# Altium project A7 Minima.PrjPcb (part 1 of 3)
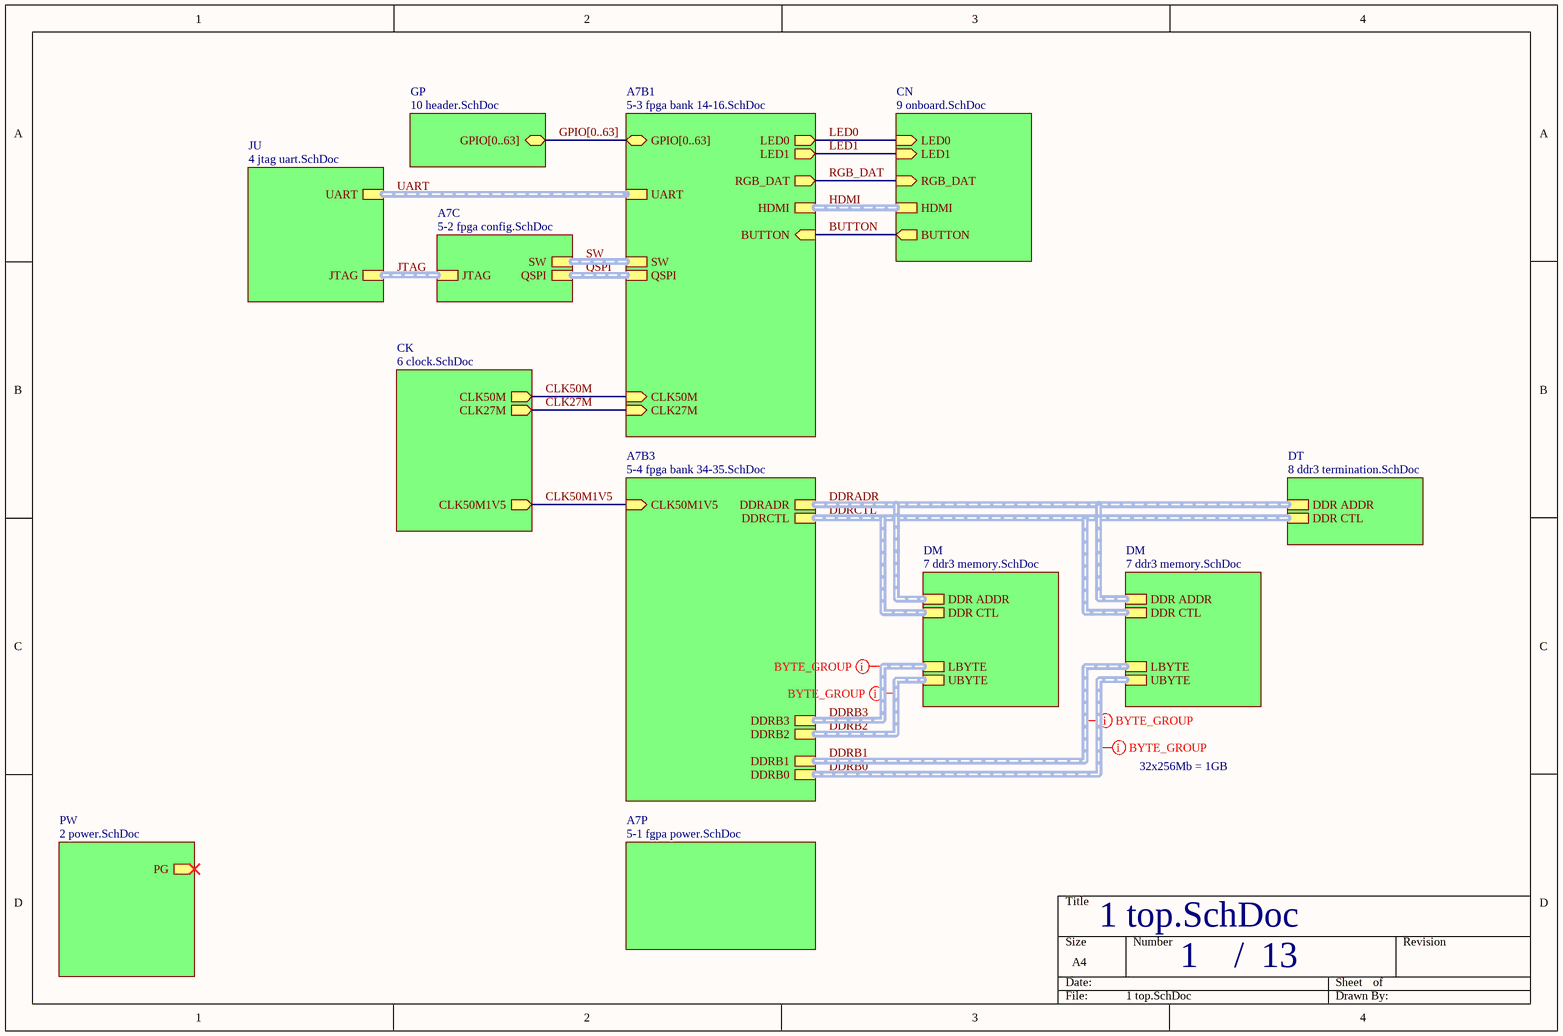
[diagram p0: 1 top.SchDoc]
13 sheets, 313 parts. Net scope: hierarchical (ports join the sheet entries above them; power ports are global).
Board files: main.PcbDoc, panel.PcbDoc
Sheets:
  1 top.SchDoc
    PW = 2 power.SchDoc
      BC = 3 buck.SchDoc
      BC = 3 buck.SchDoc
      BC = 3 buck.SchDoc
      BC = 3 buck.SchDoc
    A7P = 5-1 fgpa power.SchDoc
    CN = 9 onboard.SchDoc
    CK = 6 clock.SchDoc
    A7B3 = 5-4 fpga bank 34-35.SchDoc
    A7B1 = 5-3 fpga bank 14-16.SchDoc
    JU = 4 jtag uart.SchDoc
    A7C = 5-2 fpga config.SchDoc
    DM = 7 ddr3 memory.SchDoc
    DM = 7 ddr3 memory.SchDoc
    DT = 8 ddr3 termination.SchDoc
    GP = 10 header.SchDoc

## Sheet 1 top.SchDoc
size A4; SheetNumber: 1; SheetTotal: 13

### Sub-sheets
A7B1 = 5-3 fpga bank 14-16.SchDoc: CLK50M (in), CLK27M (in), UART (harness UART), QSPI (harness QSPI), SW (harness SW), HDMI (harness HDMI), RGB_DAT (out), GPIO[0..63] (bidir), BUTTON (in), LED0 (out), LED1 (out)
A7B3 = 5-4 fpga bank 34-35.SchDoc: DDRADR (harness DDR ADDR), DDRCTL (harness DDR CTL), DDRB3 (harness DDR BYTE), DDRB2 (harness DDR BYTE), DDRB1 (harness DDR BYTE), DDRB0 (harness DDR BYTE), CLK50M1V5 (in)
A7C = 5-2 fpga config.SchDoc: JTAG (harness JTAG), QSPI (harness QSPI), SW (harness SW)
A7P = 5-1 fgpa power.SchDoc: no entries
CK = 6 clock.SchDoc: CLK50M (out), CLK27M (out), CLK50M1V5 (out)
CN = 9 onboard.SchDoc: RGB_DAT (in), BUTTON (out), LED0 (in), LED1 (in), HDMI (harness HDMI)
DM = 7 ddr3 memory.SchDoc: LBYTE (harness DDR BYTE), UBYTE (harness DDR BYTE), DDR ADDR (harness DDR ADDR), DDR CTL (harness DDR CTL)
DM = 7 ddr3 memory.SchDoc: LBYTE (harness DDR BYTE), UBYTE (harness DDR BYTE), DDR ADDR (harness DDR ADDR), DDR CTL (harness DDR CTL)
DT = 8 ddr3 termination.SchDoc: DDR ADDR (harness DDR ADDR), DDR CTL (harness DDR CTL)
GP = 10 header.SchDoc: GPIO[0..63] (bidir)
JU = 4 jtag uart.SchDoc: JTAG (harness JTAG), UART (harness UART)
PW = 2 power.SchDoc: PG (out)

### Nets
BUTTON: sheet CN/BUTTON, sheet A7B1/BUTTON
CLK27M: sheet CK/CLK27M, sheet A7B1/CLK27M
CLK50M: sheet CK/CLK50M, sheet A7B1/CLK50M
CLK50M1V5: sheet CK/CLK50M1V5, sheet A7B3/CLK50M1V5
LED0: sheet CN/LED0, sheet A7B1/LED0
LED1: sheet CN/LED1, sheet A7B1/LED1
RGB_DAT: sheet CN/RGB_DAT, sheet A7B1/RGB_DAT

### Buses and harness runs
bus GPIO[0..63] = sheet A7B1/GPIO[0..63] = sheet GP/GPIO[0..63]
harness DDRADR = sheet A7B3/DDRADR = sheet DM/DDR ADDR = sheet DT/DDR ADDR
harness DDRB0 = sheet A7B3/DDRB0 = sheet DM/UBYTE
harness DDRB1 = sheet A7B3/DDRB1 = sheet DM/LBYTE
harness DDRB2 = sheet A7B3/DDRB2 = sheet DM/UBYTE
harness DDRB3 = sheet A7B3/DDRB3 = sheet DM/LBYTE
harness DDRCTL = sheet A7B3/DDRCTL = sheet DM/DDR CTL = sheet DT/DDR CTL
harness HDMI = sheet A7B1/HDMI = sheet CN/HDMI
harness JTAG = sheet A7C/JTAG = sheet JU/JTAG
harness QSPI = sheet A7B1/QSPI = sheet A7C/QSPI
harness SW = sheet A7B1/SW = sheet A7C/SW
harness UART = sheet A7B1/UART = sheet JU/UART

### Layout directives
net class BYTE_GROUP3: (no net found under the mark)
net class BYTE_GROUP2: (no net found under the mark)
net class BYTE_GROUP1: (no net found under the mark)
net class BYTE_GROUP0: (no net found under the mark)

### Notes on the sheet
- 32x256Mb = 1GB
- /

## Sheet 2 power.SchDoc
size A4; SheetNumber: 2; SheetTotal: 13
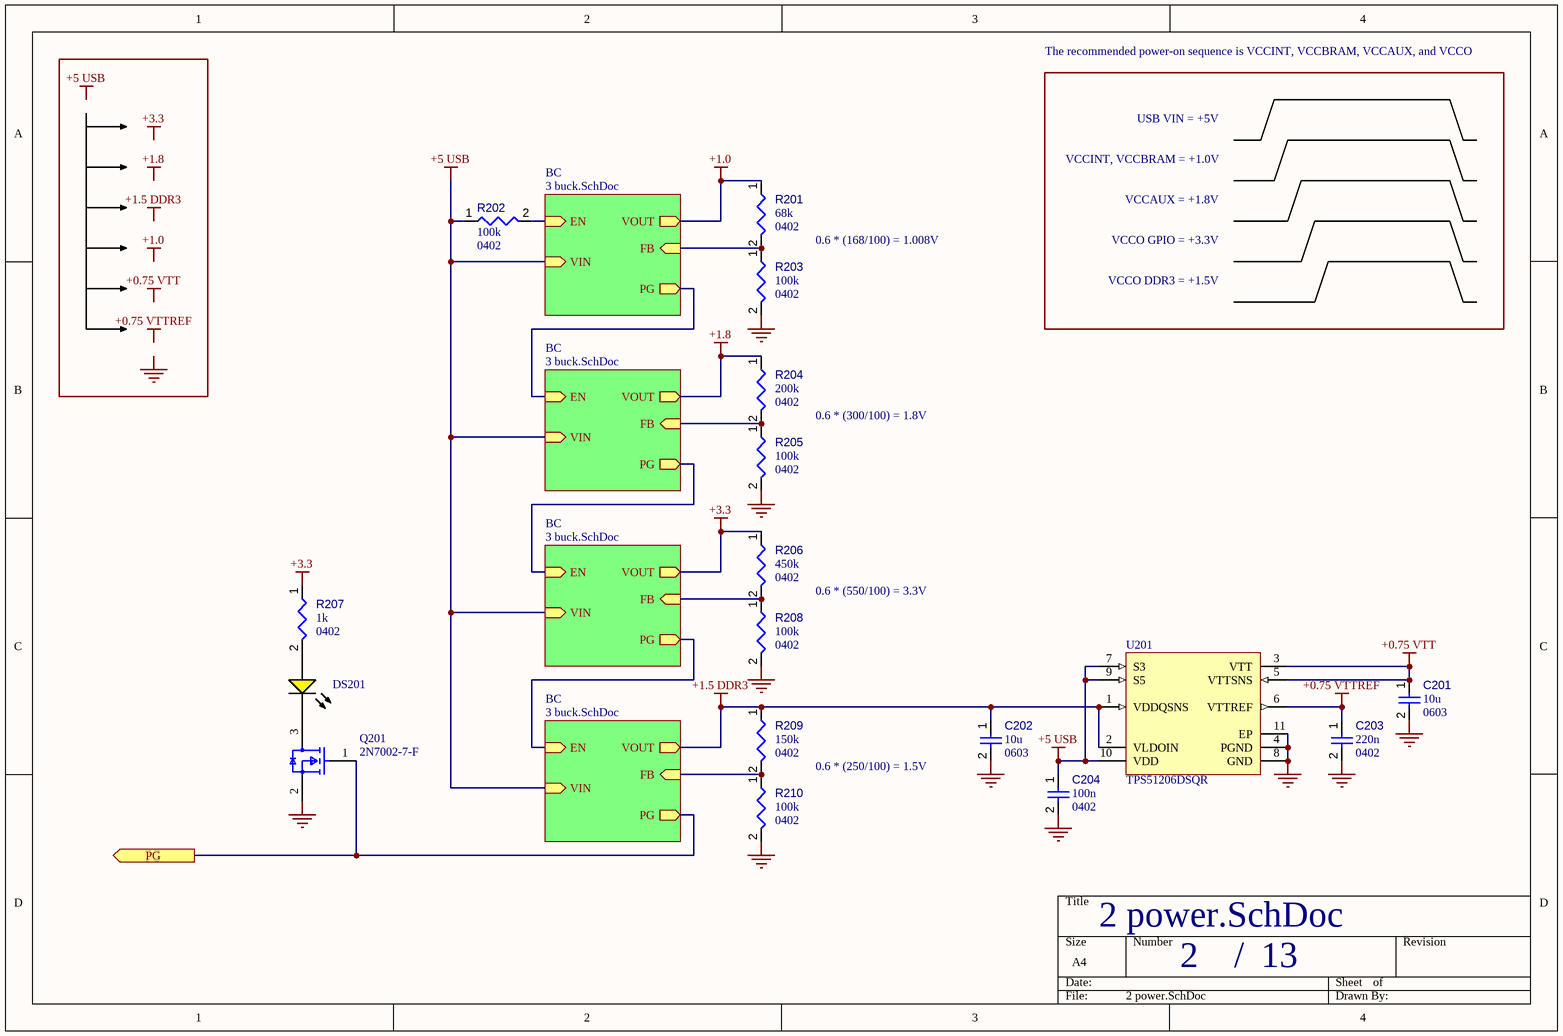
[diagram p1: 2 power.SchDoc]

### Parts
C201  value 10u  Case/Package: 0603  [CAPC0603(1608)100_L]  (hidden comment: Capacitors,0603,10u)
C202  value 10u  Case/Package: 0603  [CAPC0603(1608)100_L]  (hidden comment: Capacitors,0603,10u)
C203  value 220n  Case/Package: 0402  [CAPC0402(1005)60_L]  (hidden comment: Capacitors,0402,220n,16)
C204  value 100n  Case/Package: 0402  [CAPC0402(1005)60_L]  (hidden comment: Capacitors,0402,100n,16)
DS201  SML-LX0603YW-TR  [LUMX-SML-LX0603_V]  (value not drawn)
Q201  2N7002-7-F  [FP-SOT23-MFG]
R201  value 68k  Case/Package: 0402  [RESC0402(1005)_L]  (hidden comment: Resistors,0402,1%,68k)
R202  value 100k  Case/Package: 0402  [RESC0402(1005)_L]  (hidden comment: Resistors,0402,1%,100k)
R203  value 100k  Case/Package: 0402  [RESC0402(1005)_L]  (hidden comment: Resistors,0402,1%,100k)
R204  value 200k  Case/Package: 0402  [RESC0402(1005)_L]  (hidden comment: Resistors,0402,1%,200k)
R205  value 100k  Case/Package: 0402  [RESC0402(1005)_L]  (hidden comment: Resistors,0402,1%,100k)
R206  value 450k  Case/Package: 0402  [RESC0402(1005)_L]  (hidden comment: Resistors,0402,1%,450k)
R207  value 1k  Case/Package: 0402  [RESC0402(1005)_L]  (hidden comment: Resistors,0402,1k)
R208  value 100k  Case/Package: 0402  [RESC0402(1005)_L]  (hidden comment: Resistors,0402,1%,100k)
R209  value 150k  Case/Package: 0402  [RESC0402(1005)_L]  (hidden comment: Resistors,0402,1%,150k)
R210  value 100k  Case/Package: 0402  [RESC0402(1005)_L]  (hidden comment: Resistors,0402,1%,100k)
U201  TPS51206DSQR  [DSQ0010A_V]

### Sub-sheets
BC = 3 buck.SchDoc: EN (in), FB (in), VOUT (out), PG (out), VIN (in)
BC = 3 buck.SchDoc: EN (in), FB (in), VOUT (out), PG (out), VIN (in)
BC = 3 buck.SchDoc: EN (in), FB (in), VOUT (out), PG (out), VIN (in)
BC = 3 buck.SchDoc: EN (in), FB (in), VOUT (out), PG (out), VIN (in)

### Ports
PG (out)

### Nets
+0.75 VTT: C201.1 U201.3(VTT) U201.5(VTTSNS)
+0.75 VTTREF: C203.1 U201.6(VTTREF)
+1.0: R201.1 ; sheet BC/VOUT
+1.5 DDR3: C202.1 R209.1 U201.1(VDDQSNS) U201.2(VLDOIN) ; sheet BC/VOUT
+1.8: R204.1 ; sheet BC/VOUT
+3.3: R206.1 R207.1 ; sheet BC/VOUT
+5 USB: C204.1 R202.1 U201.7(S3) U201.9(S5) U201.10(VDD) ; sheet BC/VIN, sheet BC/VIN, sheet BC/VIN, sheet BC/VIN
GND: C201.2 C202.2 C203.2 C204.2 Q201.2(S) R203.2 R205.2 R208.2 R210.2 U201.4(PGND) U201.8(GND) U201.11(EP)
EN: R202.2 ; sheet BC/EN
EN: sheet BC/PG, sheet BC/EN  [a separate net that carries the same name]
EN: sheet BC/PG, sheet BC/EN  [a separate net that carries the same name]
EN: sheet BC/PG, sheet BC/EN  [a separate net that carries the same name]
FB: R201.2 R203.1 ; sheet BC/FB
FB: R204.2 R205.1 ; sheet BC/FB  [a separate net that carries the same name]
FB: R206.2 R208.1 ; sheet BC/FB  [a separate net that carries the same name]
FB: R209.2 R210.1 ; sheet BC/FB  [a separate net that carries the same name]
PG: Q201.1(G) ; port PG, sheet BC/PG
NetDS201_1: DS201.1(A) R207.2
NetDS201_2: DS201.2(K) Q201.3(D)

### Notes on the sheet
- The recommended power-on sequence is VCCINT, VCCBRAM, VCCAUX, and VCCO
- VCCINT, VCCBRAM = +1.0V
- USB VIN = +5V
- 0.6 * (168/100) = 1.008V
- VCCAUX = +1.8V
- VCCO GPIO = +3.3V
- VCCO DDR3 = +1.5V
- 0.6 * (300/100) = 1.8V
- 0.6 * (550/100) = 3.3V
- 0.6 * (250/100) = 1.5V
- /
- Labels drawn without touching a wire or pin: +0.75 VTT, +0.75 VTTREF, +1.0, +1.5 DDR3, +1.8, +3.3, +5 USB, GND

### Library data of the parts
C201 C202 = Capacitors: Capacitor; Component Type: Capacitors
C203 C204 = Capacitors: Capacitor; Voltage Rating: 16; Component Type: Capacitors
DS201 = CMP-2000-07121-1: Yellow LED, Milky White Diffused Lens, 2.1 V, 14 mcd, -25 to 85 degC, 2-Pin SMD, RoHS, Tape and Reel; Manufacturer: Lumex; COO: CN; Number of LEDs: 1; Type: Uni-Color; Intensity: 14mcd; Reverse Voltage: 5(Min)V; LED Material: GaAsP; Viewing Angle: 160; Peak Wavelength: 585nm; Pin_Count: 2; Lens Appearance: ColorlessDiffused; Operating Temperature: -25to85C; Color: Yellow; Mounting Technology: SurfaceMount; Package Description: 2-Pin Surface Mount Device, Body 1.6 x 0.8 mm; Mounting: SurfaceMount; Packaging: TapeandReel; RoHS: Unknown; Supplier_Package: SMD; Package Reference: SML-LX00603; Part No: SML-LX0603YW-TR; Datasheet URL: http://www.lumex.com/content/files/ProductAttachment/SML-LX0603YW-TR.pdf; Dimension: 1.6x0.8x0.6mm; Manufacturer URL: http://www.lumexinstruments.com/; HTS: 8541402000; Datasheet Version: Rev. G, 09/2013; Lens Dimensions: 1x0.8x0.3mm; Dominant Wavelength: N/A; ECCN: EARII; Supplier: Lumex; Family: SML-LX0603YW
Q201 = CMP-2000-04929-2: MOSFET N-CH 60V 115MA SOT23-3; Turn-On Delay Time: 7ns; Turn-Off Delay Time: 11ns; Drain to Source Resistance: 7.5R; Rise Time: 3ns; Drain to Source Breakdown Voltage: 70V; Input Capacitance: 50pF; Number of Elements: 1; Power Dissipation: 540mW; Max Power Dissipation: 300mW; Fall Time: 5.6ns; Gate to Source Voltage (Vgs): 20V; Threshold Voltage: 2.5V; Element Configuration: Single; Termination: SMD/SMT; Weight: 0.000282oz; Radiation Hardening: No; Max Operating Temperature: 150°C; On-State Resistance: 7.5R; Mount: Surface Mount; Current Rating: 115mA; Contact Plating: Tin; Lead Free: Lead Free; Min Operating Temperature: -55°C; Number of Pins: 3; REACH SVHC: No SVHC; Drain to Source Voltage (Vdss): 60V; Width: 1.3mm; Package Quantity: 3000; Length: 2.9mm; Case/Package: SOT-23; Number of Channels: 1; Dual Supply Voltage: 60V; Packaging: Tape and Reel; Height: 1mm; Voltage Rating (DC): 60V; Nominal Vgs: 2.5V; Continuous Drain Current (ID): 115mA; Voltage: 60V; Rds On Max: 7.5R
R201-R210 = Resistors: Resistor; Component Type: Resistors
  R201-R206 R208-R210: Tolerance: 1%
U201 = CMP-0395-00678-2: Single Output LDO, 2 A, with VTTREF Buffered Reference for DDR2, DDR3, DDR3L, 10-pin SON (DSQ), -40 to 85 degC, Green (RoHS & no Sb/Br); Manufacturer: Texas Instruments; SubFamily: Single Channel LDO; Iout(Max)(A): 2; Rating: Catalog; ComponentLink2Description: Datasheet; ComponentLink1URL: http://www.ti.com/; ComponentLink4URL: Samples URL:http://www.ti.com/product/tps51206#samples; PackageVersion: 4209243/B; Mounting Technology: Surface Mount; PackageReference: DSQ0010A; Eco-Plan: Green (RoHS & no Sb/Br); PackageDescription: 10-Pin Plastic Small Outline, Body 2 X 2 mm, Pitch 0.4 mm; ComponentLink4Description: URL Link1; DatasheetVersion: SLUSAH1; ComponentLink3URL: http://www.ti.com/litv/pdf/mpdi002c; ComponentLink2URL: http://www.ti.com/general/docs/lit/getliterature.tsp?genericPartNumber=TPS51206&fileType=pdf; PartNumber: TPS51206DSQR; ComponentLink3Description: Package Specification; ComponentLink1Description: Manufacturer URL

## Sheet 3 buck.SchDoc
size A4; SheetNumber: 3; SheetTotal: 13
Used 4 times, as channels PW/BC, PW/BC, PW/BC, PW/BC. Parts and nets are listed once, with the designators drawn on the sheet.
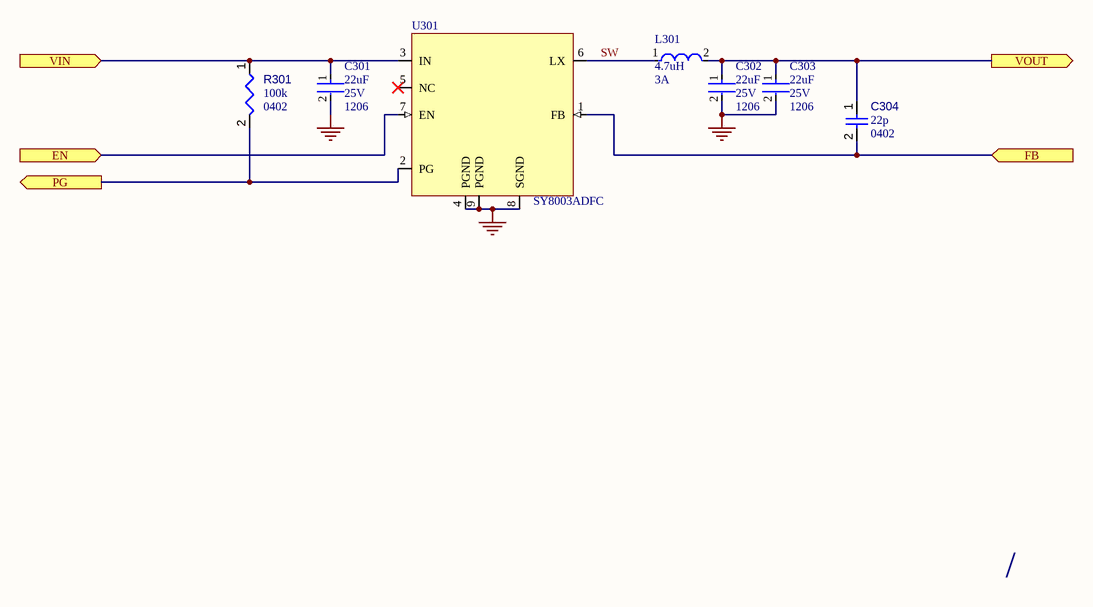
[diagram p2: 3 buck.SchDoc]

### Parts
C301  Capacitance: 22uF  Voltage Rating (DC): 25V  Case Code (Imperial): 1206  [FP-1206-L_3_2_0_3-W_1_6_0-MFG]  (hidden comment: TMK316BBJ226ML-T)
C302  Capacitance: 22uF  Voltage Rating (DC): 25V  Case Code (Imperial): 1206  [FP-1206-L_3_2_0_3-W_1_6_0-MFG]  (hidden comment: TMK316BBJ226ML-T)
C303  Capacitance: 22uF  Voltage Rating (DC): 25V  Case Code (Imperial): 1206  [FP-1206-L_3_2_0_3-W_1_6_0-MFG]  (hidden comment: TMK316BBJ226ML-T)
C304  value 22p  Case/Package: 0402  [CAPC0402(1005)60_L]  (hidden comment: Capacitors,0402,22p)
L301  Inductance: 4.7uH  Current Rating: 3A  [FP-IHLP-2525AH-FP_2_413x3-MFG]  (hidden comment: IHLP2525AHER4R7M01)
R301  value 100k  Case/Package: 0402  [RESC0402(1005)_L]  (hidden comment: Resistors,0402,1%,100k)
U301  SY8003ADFC  [DFN2x2-8]

### Ports
EN (in), FB (in), PG (out), VIN (in), VOUT (out)

### Nets
GND: C301.2 C302.2 C303.2 U301.4(PGND) U301.8(SGND) U301.9(PGND)
EN: U301.7(EN) ; port EN
FB: C304.2 U301.1(FB) ; port FB
PG: R301.2 U301.2(PG) ; port PG
SW: L301.1 U301.6(LX)  [project net SW_3]
VIN: C301.1 R301.1 U301.3(IN) ; port VIN
VOUT: C302.1 C303.1 C304.1 L301.2 ; port VOUT

Not connected (* = marked no-connect by the designer): U301 5(NC)*

### Channels
PW/BC: designators end in _PW_BC#1; ports EN=EN FB=FB PG=EN VIN=+5 USB VOUT=+1.0
PW/BC: designators end in _PW_BC#2; ports EN=EN FB=FB PG=EN VIN=+5 USB VOUT=+1.8
PW/BC: designators end in _PW_BC#3; ports EN=EN FB=FB PG=EN VIN=+5 USB VOUT=+3.3
PW/BC: designators end in _PW_BC#4; ports EN=EN FB=FB PG=PG VIN=+5 USB VOUT=+1.5 DDR3

### Notes on the sheet
- /

### Library data of the parts
C301-C303 = CMP-14477-000100-2: None; Tolerance: 20%; Dielectric: X5R; Resistor Type: Ceramic; Length: 3.2mm; RoHS Compliant: Yes; Case Code (Metric): 3216; Halogen Free: Halogen Free; Series: M; Termination: SMD/SMT; Voltage Rating: 25V; Packaging: Tape and Reel; Width: 0.063inch; Height: 1.6mm; Thickness: 0.075inch; Min Operating Temperature: -55°C; Case/Package: 1206; Mount: Surface Mount; Max Operating Temperature: 85°C; Weight: 0.000571oz; Construction: Flat; Package Quantity: 2000
C304 = Capacitors: Capacitor; Component Type: Capacitors
L301 = CMP-02424-000390-1: Commercial Inductors, High Saturation Series 4.7uH 3A 78mΩ 20%; Test Frequency: 100kHz; DC Resistance (DCR): 78mR; Saturation Current: 8A; Core Material: Metal; Shielding: Shielded; Self Resonant Frequency: 5MHz; Packaging: Tape and Reel; Height: 1.8mm; Case/Package: 2525; Mount: Surface Mount; Min Operating Temperature: -55°C; Package Quantity: 2000; RMS Current (Irms): 3A; Radiation Hardening: No; Termination: SMD/SMT; Length: 6.86mm; Military Standard: Not; Max DC Current: 8A; Depth: 6.72mm; Height - Seated (Max): 0.071inch; Tolerance: 20%; Lead Free: Lead Free; Inductance Tolerance: 20%; Width: 6.47mm; Max Operating Temperature: 125°C
R301 = Resistors: Resistor; Tolerance: 1%; Component Type: Resistors
U301 = SY8003ADFC: High Efficiency 5.5V, 3A Continuous, 1MHz Synchronous Step Down Regulator; Manufacturer: Silergy; Manufacturer Part Number: High Efficiency 5.5V, 3A continuous, 1MHz; LCSC: C178236

## Sheet 5-1 fgpa power.SchDoc
size A4; SheetNumber: 5; SheetTotal: 13
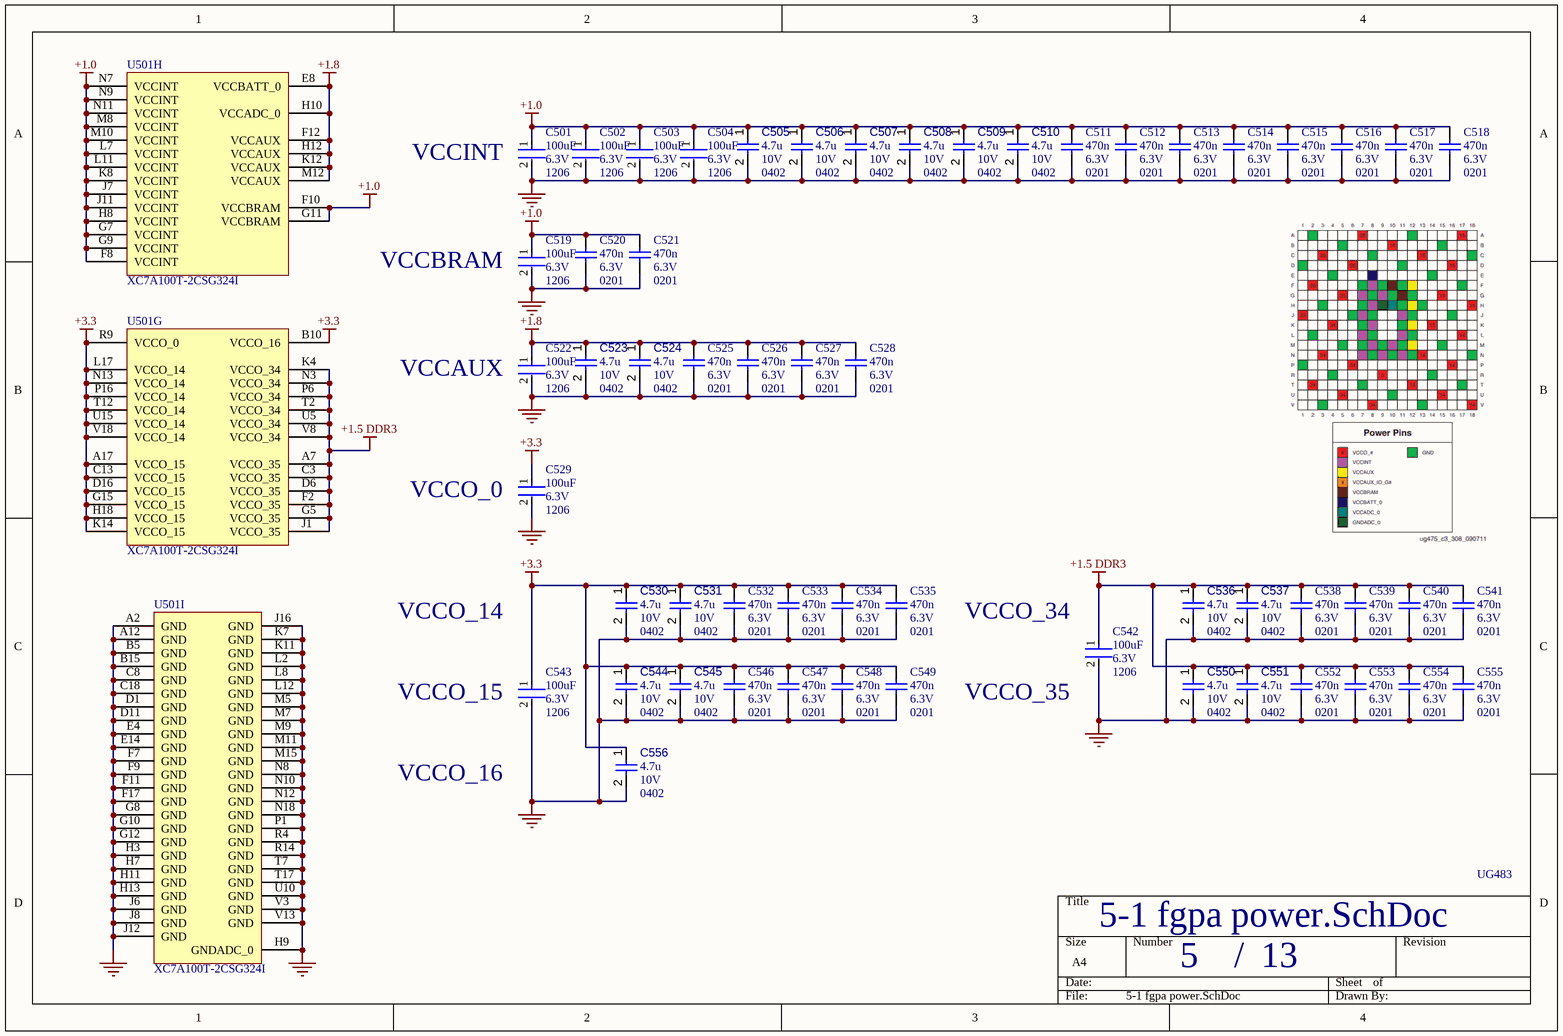
[diagram p3: 5-1 fgpa power.SchDoc]

### Parts
C501  Case Code (Imperial): 1206  Voltage Rating (DC): 6.3V  Capacitance: 100uF  [FP-C1206C-EH-MFG]  (hidden comment: C1206C107M9PACTU)
C502  Case Code (Imperial): 1206  Voltage Rating (DC): 6.3V  Capacitance: 100uF  [FP-C1206C-EH-MFG]  (hidden comment: C1206C107M9PACTU)
C503  Case Code (Imperial): 1206  Voltage Rating (DC): 6.3V  Capacitance: 100uF  [FP-C1206C-EH-MFG]  (hidden comment: C1206C107M9PACTU)
C504  Case Code (Imperial): 1206  Voltage Rating (DC): 6.3V  Capacitance: 100uF  [FP-C1206C-EH-MFG]  (hidden comment: C1206C107M9PACTU)
C505  value 4.7u  Case/Package: 0402  Voltage Rating: 10V  [CAPC0402(1005)60_L]  (hidden comment: Capacitors,0402,4.7u,10V)
C506  value 4.7u  Case/Package: 0402  Voltage Rating: 10V  [CAPC0402(1005)60_L]  (hidden comment: Capacitors,0402,4.7u,10V)
C507  value 4.7u  Case/Package: 0402  Voltage Rating: 10V  [CAPC0402(1005)60_L]  (hidden comment: Capacitors,0402,4.7u,10V)
C508  value 4.7u  Case/Package: 0402  Voltage Rating: 10V  [CAPC0402(1005)60_L]  (hidden comment: Capacitors,0402,4.7u,10V)
C509  value 4.7u  Case/Package: 0402  Voltage Rating: 10V  [CAPC0402(1005)60_L]  (hidden comment: Capacitors,0402,4.7u,10V)
C510  value 4.7u  Case/Package: 0402  Voltage Rating: 10V  [CAPC0402(1005)60_L]  (hidden comment: Capacitors,0402,4.7u,10V)
C511  value 470n  Voltage Rating: 6.3V  Package: 0201  [CAPC0603X33X15LL03T05]  (hidden comment: 02016D474KAT2A)
C512  value 470n  Voltage Rating: 6.3V  Package: 0201  [CAPC0603X33X15LL03T05]  (hidden comment: 02016D474KAT2A)
C513  value 470n  Voltage Rating: 6.3V  Package: 0201  [CAPC0603X33X15LL03T05]  (hidden comment: 02016D474KAT2A)
C514  value 470n  Voltage Rating: 6.3V  Package: 0201  [CAPC0603X33X15LL03T05]  (hidden comment: 02016D474KAT2A)
C515  value 470n  Voltage Rating: 6.3V  Package: 0201  [CAPC0603X33X15LL03T05]  (hidden comment: 02016D474KAT2A)
C516  value 470n  Voltage Rating: 6.3V  Package: 0201  [CAPC0603X33X15LL03T05]  (hidden comment: 02016D474KAT2A)
C517  value 470n  Voltage Rating: 6.3V  Package: 0201  [CAPC0603X33X15LL03T05]  (hidden comment: 02016D474KAT2A)
C518  value 470n  Voltage Rating: 6.3V  Package: 0201  [CAPC0603X33X15LL03T05]  (hidden comment: 02016D474KAT2A)
C519  Case Code (Imperial): 1206  Voltage Rating (DC): 6.3V  Capacitance: 100uF  [FP-C1206C-EH-MFG]  (hidden comment: C1206C107M9PACTU)
C520  value 470n  Voltage Rating: 6.3V  Package: 0201  [CAPC0603X33X15LL03T05]  (hidden comment: 02016D474KAT2A)
C521  value 470n  Voltage Rating: 6.3V  Package: 0201  [CAPC0603X33X15LL03T05]  (hidden comment: 02016D474KAT2A)
C522  Case Code (Imperial): 1206  Voltage Rating (DC): 6.3V  Capacitance: 100uF  [FP-C1206C-EH-MFG]  (hidden comment: C1206C107M9PACTU)
C523  value 4.7u  Case/Package: 0402  Voltage Rating: 10V  [CAPC0402(1005)60_L]  (hidden comment: Capacitors,0402,4.7u,10V)
C524  value 4.7u  Case/Package: 0402  Voltage Rating: 10V  [CAPC0402(1005)60_L]  (hidden comment: Capacitors,0402,4.7u,10V)
C525  value 470n  Voltage Rating: 6.3V  Package: 0201  [CAPC0603X33X15LL03T05]  (hidden comment: 02016D474KAT2A)
C526  value 470n  Voltage Rating: 6.3V  Package: 0201  [CAPC0603X33X15LL03T05]  (hidden comment: 02016D474KAT2A)
C527  value 470n  Voltage Rating: 6.3V  Package: 0201  [CAPC0603X33X15LL03T05]  (hidden comment: 02016D474KAT2A)
C528  value 470n  Voltage Rating: 6.3V  Package: 0201  [CAPC0603X33X15LL03T05]  (hidden comment: 02016D474KAT2A)
C529  Case Code (Imperial): 1206  Voltage Rating (DC): 6.3V  Capacitance: 100uF  [FP-C1206C-EH-MFG]  (hidden comment: C1206C107M9PACTU)
C530  value 4.7u  Case/Package: 0402  Voltage Rating: 10V  [CAPC0402(1005)60_L]  (hidden comment: Capacitors,0402,4.7u,10V)
C531  value 4.7u  Case/Package: 0402  Voltage Rating: 10V  [CAPC0402(1005)60_L]  (hidden comment: Capacitors,0402,4.7u,10V)
C532  value 470n  Voltage Rating: 6.3V  Package: 0201  [CAPC0603X33X15LL03T05]  (hidden comment: 02016D474KAT2A)
C533  value 470n  Voltage Rating: 6.3V  Package: 0201  [CAPC0603X33X15LL03T05]  (hidden comment: 02016D474KAT2A)
C534  value 470n  Voltage Rating: 6.3V  Package: 0201  [CAPC0603X33X15LL03T05]  (hidden comment: 02016D474KAT2A)
C535  value 470n  Voltage Rating: 6.3V  Package: 0201  [CAPC0603X33X15LL03T05]  (hidden comment: 02016D474KAT2A)
C536  value 4.7u  Case/Package: 0402  Voltage Rating: 10V  [CAPC0402(1005)60_L]  (hidden comment: Capacitors,0402,4.7u,10V)
C537  value 4.7u  Case/Package: 0402  Voltage Rating: 10V  [CAPC0402(1005)60_L]  (hidden comment: Capacitors,0402,4.7u,10V)
C538  value 470n  Voltage Rating: 6.3V  Package: 0201  [CAPC0603X33X15LL03T05]  (hidden comment: 02016D474KAT2A)
C539  value 470n  Voltage Rating: 6.3V  Package: 0201  [CAPC0603X33X15LL03T05]  (hidden comment: 02016D474KAT2A)
C540  value 470n  Voltage Rating: 6.3V  Package: 0201  [CAPC0603X33X15LL03T05]  (hidden comment: 02016D474KAT2A)
C541  value 470n  Voltage Rating: 6.3V  Package: 0201  [CAPC0603X33X15LL03T05]  (hidden comment: 02016D474KAT2A)
C542  Case Code (Imperial): 1206  Voltage Rating (DC): 6.3V  Capacitance: 100uF  [FP-C1206C-EH-MFG]  (hidden comment: C1206C107M9PACTU)
C543  Case Code (Imperial): 1206  Voltage Rating (DC): 6.3V  Capacitance: 100uF  [FP-C1206C-EH-MFG]  (hidden comment: C1206C107M9PACTU)
C544  value 4.7u  Case/Package: 0402  Voltage Rating: 10V  [CAPC0402(1005)60_L]  (hidden comment: Capacitors,0402,4.7u,10V)
C545  value 4.7u  Case/Package: 0402  Voltage Rating: 10V  [CAPC0402(1005)60_L]  (hidden comment: Capacitors,0402,4.7u,10V)
C546  value 470n  Voltage Rating: 6.3V  Package: 0201  [CAPC0603X33X15LL03T05]  (hidden comment: 02016D474KAT2A)
C547  value 470n  Voltage Rating: 6.3V  Package: 0201  [CAPC0603X33X15LL03T05]  (hidden comment: 02016D474KAT2A)
C548  value 470n  Voltage Rating: 6.3V  Package: 0201  [CAPC0603X33X15LL03T05]  (hidden comment: 02016D474KAT2A)
C549  value 470n  Voltage Rating: 6.3V  Package: 0201  [CAPC0603X33X15LL03T05]  (hidden comment: 02016D474KAT2A)
C550  value 4.7u  Case/Package: 0402  Voltage Rating: 10V  [CAPC0402(1005)60_L]  (hidden comment: Capacitors,0402,4.7u,10V)
C551  value 4.7u  Case/Package: 0402  Voltage Rating: 10V  [CAPC0402(1005)60_L]  (hidden comment: Capacitors,0402,4.7u,10V)
C552  value 470n  Voltage Rating: 6.3V  Package: 0201  [CAPC0603X33X15LL03T05]  (hidden comment: 02016D474KAT2A)
C553  value 470n  Voltage Rating: 6.3V  Package: 0201  [CAPC0603X33X15LL03T05]  (hidden comment: 02016D474KAT2A)
C554  value 470n  Voltage Rating: 6.3V  Package: 0201  [CAPC0603X33X15LL03T05]  (hidden comment: 02016D474KAT2A)
C555  value 470n  Voltage Rating: 6.3V  Package: 0201  [CAPC0603X33X15LL03T05]  (hidden comment: 02016D474KAT2A)
C556  value 4.7u  Case/Package: 0402  Voltage Rating: 10V  [CAPC0402(1005)60_L]  (hidden comment: Capacitors,0402,4.7u,10V)
U501  XC7A100T-2CSG324I  [CSG324]  (parts G,H,I of 9)

### Nets
+1.0: C501.1 C502.1 C503.1 C504.1 C505.1 C506.1 C507.1 C508.1 C509.1 C510.1 C511.1 C512.1 C513.1 C514.1 C515.1 C516.1 C517.1 C518.1 C519.1 C520.1 C521.1 U501.F8(VCCINT) U501.F10(VCCBRAM) U501.G7(VCCINT) U501.G9(VCCINT) U501.G11(VCCBRAM) U501.H8(VCCINT) U501.J7(VCCINT) U501.J11(VCCINT) U501.K8(VCCINT) U501.L7(VCCINT) U501.L11(VCCINT) U501.M8(VCCINT) U501.M10(VCCINT) U501.N7(VCCINT) U501.N9(VCCINT) U501.N11(VCCINT)
+1.5 DDR3: C536.1 C537.1 C538.1 C539.1 C540.1 C541.1 C542.1 C550.1 C551.1 C552.1 C553.1 C554.1 C555.1 U501.A7(VCCO_35) U501.C3(VCCO_35) U501.D6(VCCO_35) U501.F2(VCCO_35) U501.G5(VCCO_35) U501.J1(VCCO_35) U501.K4(VCCO_34) U501.N3(VCCO_34) U501.P6(VCCO_34) U501.T2(VCCO_34) U501.U5(VCCO_34) U501.V8(VCCO_34)
+1.8: C522.1 C523.1 C524.1 C525.1 C526.1 C527.1 C528.1 U501.E8(VCCBATT_0) U501.F12(VCCAUX) U501.H10(VCCADC_0) U501.H12(VCCAUX) U501.K12(VCCAUX) U501.M12(VCCAUX)
+3.3: C529.1 C530.1 C531.1 C532.1 C533.1 C534.1 C535.1 C543.1 C544.1 C545.1 C546.1 C547.1 C548.1 C549.1 C556.1 U501.A17(VCCO_15) U501.B10(VCCO_16) U501.C13(VCCO_15) U501.D16(VCCO_15) U501.G15(VCCO_15) U501.H18(VCCO_15) U501.K14(VCCO_15) U501.L17(VCCO_14) U501.N13(VCCO_14) U501.P16(VCCO_14) U501.R9(VCCO_0) U501.T12(VCCO_14) U501.U15(VCCO_14) U501.V18(VCCO_14)
GND: C501.2 C502.2 C503.2 C504.2 C505.2 C506.2 C507.2 C508.2 C509.2 C510.2 C511.2 C512.2 C513.2 C514.2 C515.2 C516.2 C517.2 C518.2 C519.2 C520.2 C521.2 C522.2 C523.2 C524.2 C525.2 C526.2 C527.2 C528.2 C529.2 C530.2 C531.2 C532.2 C533.2 C534.2 C535.2 C536.2 C537.2 C538.2 C539.2 C540.2 C541.2 C542.2 C543.2 C544.2 C545.2 C546.2 C547.2 C548.2 C549.2 C550.2 C551.2 C552.2 C553.2 C554.2 C555.2 C556.2 U501.A2(GND) U501.A12(GND) U501.B5(GND) U501.B15(GND) U501.C8(GND) U501.C18(GND) U501.D1(GND) U501.D11(GND) U501.E4(GND) U501.E14(GND) U501.F7(GND) U501.F9(GND) U501.F11(GND) U501.F17(GND) U501.G8(GND) U501.G10(GND) U501.G12(GND) U501.H3(GND) U501.H7(GND) U501.H9(GNDADC_0) U501.H11(GND) U501.H13(GND) U501.J6(GND) U501.J8(GND) U501.J12(GND) U501.J16(GND) U501.K7(GND) U501.K11(GND) U501.L2(GND) U501.L8(GND) U501.L12(GND) U501.M5(GND) U501.M7(GND) U501.M9(GND) U501.M11(GND) U501.M15(GND) U501.N8(GND) U501.N10(GND) U501.N12(GND) U501.N18(GND) U501.P1(GND) U501.R4(GND) U501.R14(GND) U501.T7(GND) U501.T17(GND) U501.U10(GND) U501.V3(GND) U501.V13(GND)

### Notes on the sheet
- (near C501) VCCINT
- (near C519) VCCBRAM
- (near C522) VCCAUX
- (near C529) VCCO_0
- VCCO_14
- (near C542) VCCO_34
- (near C543) VCCO_15
- (near C542) VCCO_35
- VCCO_16
- UG483
- /

### Library data of the parts
C501-C504 C519 C522 C529 C542 C543 = CMP-1037-05005-3: CAP CER 100UF 6.3V X5R 1206; Dielectric Material: Ceramic; Tolerance: 2%; Dissipation Factor: 5%; Min Operating Temperature: -55°C; Case Code (Metric): 3216; Depth: 1.6mm; Dielectric: X5R; Max Operating Temperature: 85°C; Packaging: Tape and Reel; Construction: Flat; Series: C; Case/Package: 1206; Radiation Hardening: No; Termination: SMD/SMT; Voltage Rating: 6.3V; Number of Pins: 2; RoHS Compliant: Yes; Height: 1.6mm; Lead Free: Lead Free; Voltage: 6.3V; REACH SVHC: No SVHC; Length: 3.2mm; Mount: Surface Mount; Package Quantity: 1; Thickness: 0.071inch; Width: 0.063inch
C505-C510 C523 C524 C530 C531 C536 C537 C544 C545 C550 C551 C556 = Capacitors: Capacitor; Component Type: Capacitors
C511-C518 C520 C521 C525-C528 C532-C535 C538-C541 C546-C549 C552-C555 = CMP-2010-00405-1: Manufacturer: AVX Interconnect / Elco; Part Number: 02016D474KAT2A
U501 = CMP-0364-00002-3: Artix-7 FPGA, 210 User I/Os, 0 GTP, 324-Ball BGA, Speed Grade 2, Extended Grade, Pb-Free; Manufacturer: Xilinx; Block RAM Blocks (36Kb): 135; Logic Cells: 101440; Clock Mgmt Tiles (CMTs): 6; Block RAM Blocks (18Kb): 270; CLBs (Slices): 15850; Block RAM Blocks (Max Kb): 4860; Max User I/O: 300; Speed Grade: -2; DSP48E1 Slices: 240; ComponentLink5URL: http://www.xilinx.com/support/documentation/user_guides/ug475_7Series_Pkg_Pinout.pdf; ComponentLink4Description: Package File; PackageDescription: Wire-Bond Chip-Scale BGA, Body 15 x 15 mm, 0.8 mm Pitch; RoHS: Pb-Free; ComponentLink5Description: Packaging and Pinout; ComponentLink2URL: http://www.xilinx.com/support/documentation/user_guides/ug475_7Series_Pkg_Pinout.pdf; ComponentLink2Description: Package Specification; PartNumber: XC7A100T-2CSG324I; Mounting Technology: Surface Mount; ComponentLink3Description: DC and Switching Characteristics; PackageVersion: Rev 1.8; Code_JEDEC: MO-275-KKAC-1; PackageReference: CSG324; NexusDeviceID: XC7A100T-2CSG324I; ComponentLink4URL: http://www.xilinx.com/support/packagefiles/a7packages/xc7a100tcsg324pkg.txt; ComponentLink3URL: http://www.xilinx.com/support/documentation/data_sheets/ds181_Artix_7_Data_Sheet.pdf; ComponentLink1Description: Datasheet; DatasheetVersion: v1.12; ComponentLink1URL: http://www.xilinx.com/support/documentation/data_sheets/ds180_7Series_Overview.pdf; Generic Part Number: XC7A100T; CLBs (Max Distributed RAM Kb): 1188

## Sheet 9 onboard.SchDoc
size A4; SheetNumber: 12; SheetTotal: 13
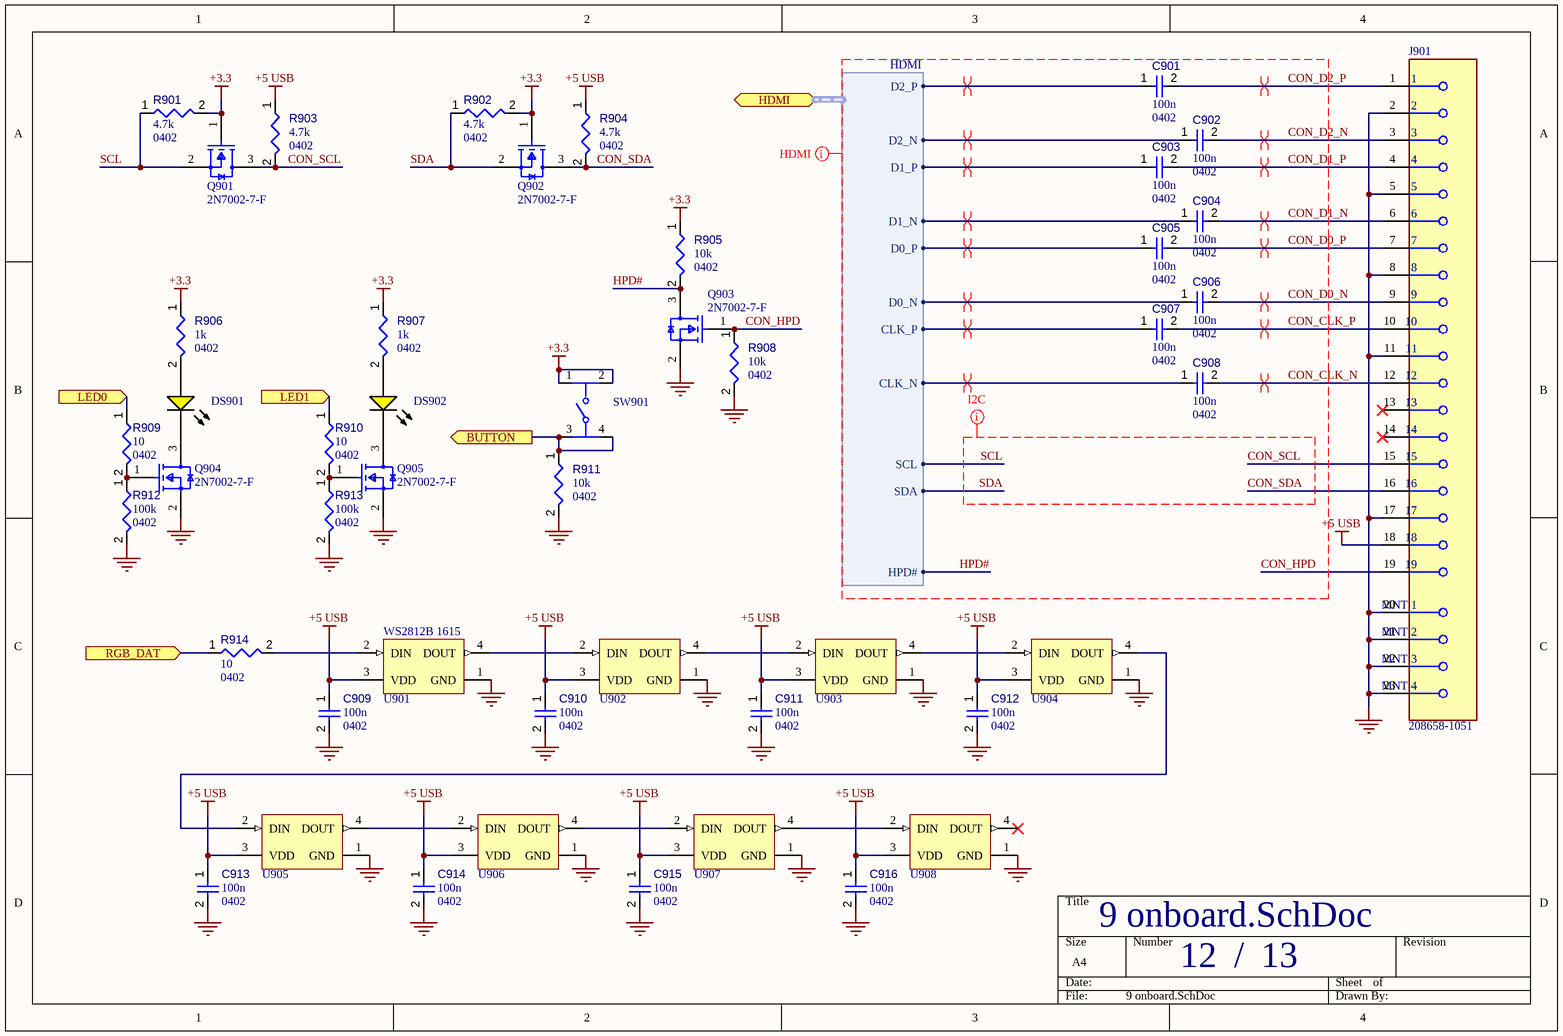
[diagram p4: 9 onboard.SchDoc]

### Parts
C901  value 100n  Case/Package: 0402  [CAPC0402(1005)60_L]  (hidden comment: Capacitors,0402,100n,16)
C902  value 100n  Case/Package: 0402  [CAPC0402(1005)60_L]  (hidden comment: Capacitors,0402,100n,16)
C903  value 100n  Case/Package: 0402  [CAPC0402(1005)60_L]  (hidden comment: Capacitors,0402,100n,16)
C904  value 100n  Case/Package: 0402  [CAPC0402(1005)60_L]  (hidden comment: Capacitors,0402,100n,16)
C905  value 100n  Case/Package: 0402  [CAPC0402(1005)60_L]  (hidden comment: Capacitors,0402,100n,16)
C906  value 100n  Case/Package: 0402  [CAPC0402(1005)60_L]  (hidden comment: Capacitors,0402,100n,16)
C907  value 100n  Case/Package: 0402  [CAPC0402(1005)60_L]  (hidden comment: Capacitors,0402,100n,16)
C908  value 100n  Case/Package: 0402  [CAPC0402(1005)60_L]  (hidden comment: Capacitors,0402,100n,16)
C909  value 100n  Case/Package: 0402  [CAPC0402(1005)60_L]  (hidden comment: Capacitors,0402,100n,16)
C910  value 100n  Case/Package: 0402  [CAPC0402(1005)60_L]  (hidden comment: Capacitors,0402,100n,16)
C911  value 100n  Case/Package: 0402  [CAPC0402(1005)60_L]  (hidden comment: Capacitors,0402,100n,16)
C912  value 100n  Case/Package: 0402  [CAPC0402(1005)60_L]  (hidden comment: Capacitors,0402,100n,16)
C913  value 100n  Case/Package: 0402  [CAPC0402(1005)60_L]  (hidden comment: Capacitors,0402,100n,16)
C914  value 100n  Case/Package: 0402  [CAPC0402(1005)60_L]  (hidden comment: Capacitors,0402,100n,16)
C915  value 100n  Case/Package: 0402  [CAPC0402(1005)60_L]  (hidden comment: Capacitors,0402,100n,16)
C916  value 100n  Case/Package: 0402  [CAPC0402(1005)60_L]  (hidden comment: Capacitors,0402,100n,16)
DS901  SML-LX0603YW-TR  [LUMX-SML-LX0603_V]  (value not drawn)
DS902  SML-LX0603YW-TR  [LUMX-SML-LX0603_V]  (value not drawn)
J901  208658-1051  [FP-208658-1051-MFG]
Q901  2N7002-7-F  [FP-SOT23-MFG]
Q902  2N7002-7-F  [FP-SOT23-MFG]
Q903  2N7002-7-F  [FP-SOT23-MFG]
Q904  2N7002-7-F  [FP-SOT23-MFG]
Q905  2N7002-7-F  [FP-SOT23-MFG]
R901  value 4.7k  Case/Package: 0402  [RESC0402(1005)_L]  (hidden comment: Resistors,0402,4.7k)
R902  value 4.7k  Case/Package: 0402  [RESC0402(1005)_L]  (hidden comment: Resistors,0402,4.7k)
R903  value 4.7k  Case/Package: 0402  [RESC0402(1005)_L]  (hidden comment: Resistors,0402,4.7k)
R904  value 4.7k  Case/Package: 0402  [RESC0402(1005)_L]  (hidden comment: Resistors,0402,4.7k)
R905  value 10k  Case/Package: 0402  [RESC0402(1005)_L]  (hidden comment: Resistors,0402,10k)
R906  value 1k  Case/Package: 0402  [RESC0402(1005)_L]  (hidden comment: Resistors,0402,1k)
R907  value 1k  Case/Package: 0402  [RESC0402(1005)_L]  (hidden comment: Resistors,0402,1k)
R908  value 10k  Case/Package: 0402  [RESC0402(1005)_L]  (hidden comment: Resistors,0402,10k)
R909  value 10  Case/Package: 0402  [RESC0402(1005)_L]  (hidden comment: Resistors,0402,10)
R910  value 10  Case/Package: 0402  [RESC0402(1005)_L]  (hidden comment: Resistors,0402,10)
R911  value 10k  Case/Package: 0402  [RESC0402(1005)_L]  (hidden comment: Resistors,0402,10k)
R912  value 100k  Case/Package: 0402  [RESC0402(1005)_L]  (hidden comment: Resistors,0402,1%,100k)
R913  value 100k  Case/Package: 0402  [RESC0402(1005)_L]  (hidden comment: Resistors,0402,1%,100k)
R914  value 10  Case/Package: 0402  [RESC0402(1005)_L]  (hidden comment: Resistors,0402,10)
SW901  PTS810SJM250SMTRLFS  [FP-PTS810SJM250SMTRLFS-MFG]  (value not drawn)
U901  WS2812B 1615  [WS2812B 1615]
U902  WS2812B 1615  [WS2812B 1615]  (value not drawn)
U903  WS2812B 1615  [WS2812B 1615]  (value not drawn)
U904  WS2812B 1615  [WS2812B 1615]  (value not drawn)
U905  WS2812B 1615  [WS2812B 1615]  (value not drawn)
U906  WS2812B 1615  [WS2812B 1615]  (value not drawn)
U907  WS2812B 1615  [WS2812B 1615]  (value not drawn)
U908  WS2812B 1615  [WS2812B 1615]  (value not drawn)

### Ports
BUTTON (out), HDMI (bidir, harness HDMI), LED0 (in), LED1 (in), RGB_DAT (in)

### Harnesses
HDMI: D0_P, D0_N, D1_P, D1_N, D2_P, D2_N, CLK_P, CLK_N, SCL, SDA, HPD#

### Nets
+3.3: Q901.1(G) Q902.1(G) R901.2 R902.2 R905.1 R906.1 R907.1 SW901.1 SW901.2
+5 USB: C909.1 C910.1 C911.1 C912.1 C913.1 C914.1 C915.1 C916.1 J901.18 R903.1 R904.1 U901.3(VDD) U902.3(VDD) U903.3(VDD) U904.3(VDD) U905.3(VDD) U906.3(VDD) U907.3(VDD) U908.3(VDD)
GND: C909.2 C910.2 C911.2 C912.2 C913.2 C914.2 C915.2 C916.2 J901.2 J901.5 J901.8 J901.11 J901.17 J901.20(MNT_1) J901.21(MNT_2) J901.22(MNT_3) J901.23(MNT_4) Q903.2(S) Q904.2(S) Q905.2(S) R908.2 R911.2 R912.2 R913.2 U901.1(GND) U902.1(GND) U903.1(GND) U904.1(GND) U905.1(GND) U906.1(GND) U907.1(GND) U908.1(GND)
BUTTON: R911.1 SW901.3 SW901.4 ; port BUTTON
CON_CLK_N: C908.2 J901.12  [project net CON_CLK_N_12]
CON_CLK_P: C907.2 J901.10  [project net CON_CLK_P_12]
CON_D0_N: C906.2 J901.9  [project net CON_D0_N_12]
CON_D0_P: C905.2 J901.7  [project net CON_D0_P_12]
CON_D1_N: C904.2 J901.6  [project net CON_D1_N_12]
CON_D1_P: C903.2 J901.4  [project net CON_D1_P_12]
CON_D2_N: C902.2 J901.3  [project net CON_D2_N_12]
CON_D2_P: C901.2 J901.1  [project net CON_D2_P_12]
CON_HPD: J901.19 Q903.1(G) R908.1  [project net CON_HPD_12]
CON_SCL: J901.15 Q901.3(D) R903.2  [project net CON_SCL_12]
CON_SDA: J901.16 Q902.3(D) R904.2  [project net CON_SDA_12]
HDMI.CLK_N: C908.1 ; port HDMI.CLK_N
HDMI.CLK_P: C907.1 ; port HDMI.CLK_P
HDMI.D0_N: C906.1 ; port HDMI.D0_N
HDMI.D0_P: C905.1 ; port HDMI.D0_P
HDMI.D1_N: C904.1 ; port HDMI.D1_N
HDMI.D1_P: C903.1 ; port HDMI.D1_P
HDMI.D2_N: C902.1 ; port HDMI.D2_N
HDMI.D2_P: C901.1 ; port HDMI.D2_P
HPD#: Q903.3(D) R905.2 ; port HDMI.HPD#  [project net HDMI.HPD#]
LED0: R909.1 ; port LED0
LED1: R910.1 ; port LED1
RGB_DAT: R914.1 ; port RGB_DAT
SCL: Q901.2(S) R901.1 ; port HDMI.SCL  [project net HDMI.SCL]
SDA: Q902.2(S) R902.1 ; port HDMI.SDA  [project net HDMI.SDA]
NetDS901_1: DS901.1(A) R906.2
NetDS901_2: DS901.2(K) Q904.3(D)
NetDS902_1: DS902.1(A) R907.2
NetDS902_2: DS902.2(K) Q905.3(D)
NetQ904_1: Q904.1(G) R909.2 R912.1
NetQ905_1: Q905.1(G) R910.2 R913.1
NetR914_2: R914.2 U901.2(DIN)
NetU901_4: U901.4(DOUT) U902.2(DIN)
NetU902_4: U902.4(DOUT) U903.2(DIN)
NetU903_4: U903.4(DOUT) U904.2(DIN)
NetU904_4: U904.4(DOUT) U905.2(DIN)
NetU905_4: U905.4(DOUT) U906.2(DIN)
NetU906_4: U906.4(DOUT) U907.2(DIN)
NetU907_4: U907.4(DOUT) U908.2(DIN)

Not connected (* = marked no-connect by the designer): J901 13* 14*; U908 4(DOUT)*

### Layout directives
differential pair: CON_CLK_N_12, CON_CLK_P_12, CON_D0_N_12, CON_D0_P_12, CON_D1_N_12, CON_D1_P_12, CON_D2_N_12, CON_D2_P_12, HDMI.CLK_N, HDMI.CLK_P, HDMI.D0_N, HDMI.D0_P, HDMI.D1_N, HDMI.D1_P, HDMI.D2_N, HDMI.D2_P
net class HDMI: CON_CLK_N, CON_CLK_P, CON_D0_N, CON_D0_P, CON_D1_N, CON_D1_P, CON_D2_N, CON_D2_P, CON_HPD, CON_SCL, CON_SDA, HPD#, SCL, SDA
net class I2C: CON_SCL, CON_SDA, SCL, SDA

### Notes on the sheet
- /

### Library data of the parts
C901-C916 = Capacitors: Capacitor; Voltage Rating: 16; Component Type: Capacitors
DS901 DS902 = CMP-2000-07121-1: as DS201 on sheet 2 power; Operating Temperature: -25to85C; Color: Yellow; Mounting Technology: SurfaceMount; Package Description: 2-Pin Surface Mount Device, Body 1.6 x 0.8 mm; Mounting: SurfaceMount; Packaging: TapeandReel; RoHS: Unknown; Supplier_Package: SMD; Package Reference: SML-LX00603; Part No: SML-LX0603YW-TR; Datasheet URL: http://www.lumex.com/content/files/ProductAttachment/SML-LX0603YW-TR.pdf; Dimension: 1.6x0.8x0.6mm; Manufacturer URL: http://www.lumexinstruments.com/; HTS: 8541402000; Datasheet Version: Rev. G, 09/2013; Lens Dimensions: 1x0.8x0.3mm; Dominant Wavelength: N/A; ECCN: EARII; Supplier: Lumex; Family: SML-LX0603YW
J901 = CMP-04768-000005-1: CONN RCPT HDMI V2.1 19POS SMD RA
Q901-Q905 = CMP-2000-04929-2: as Q201 on sheet 2 power; Termination: SMD/SMT; Weight: 0.000282oz; Radiation Hardening: No; Max Operating Temperature: 150°C; On-State Resistance: 7.5R; Mount: Surface Mount; Current Rating: 115mA; Contact Plating: Tin; Lead Free: Lead Free; Min Operating Temperature: -55°C; Number of Pins: 3; REACH SVHC: No SVHC; Drain to Source Voltage (Vdss): 60V; Width: 1.3mm; Package Quantity: 3000; Length: 2.9mm; Case/Package: SOT-23; Number of Channels: 1; Dual Supply Voltage: 60V; Packaging: Tape and Reel; Height: 1mm; Voltage Rating (DC): 60V; Nominal Vgs: 2.5V; Continuous Drain Current (ID): 115mA; Voltage: 60V; Rds On Max: 7.5R
R901-R914 = Resistors: Resistor; Component Type: Resistors
  R912 R913: Tolerance: 1%
SW901 = CMP-10040-000001-2: SWITCH TACTILE SPST-NO 0.05A 16V; Throw Configuration: SPST; Operating Force: 160gf; Actuator Type: Standard; Switch Travel: 0.15mm; Switch Function: Off-Mom; Max Current Rating: 50mA; Mechanical Life: 150000Cycles; Illumination Type: Non-Illuminated; Package Quantity: 2900; Depth: 4.6mm; Mount: Surface Mount; Packaging: Tape and Reel; Length: 3.2mm; RoHS Compliant: Yes; Case/Package: SMD/SMT; Voltage Rating (DC): 16V; Min Operating Temperature: -40°C; Termination: J-Bend; Lead Free: Lead Free; Contact Plating: Silver; Orientation: Straight; Max Operating Temperature: 85°C; Current Rating: 50mA; Color: Black

## Sheet 6 clock.SchDoc
size A4; SheetNumber: 9; SheetTotal: 13
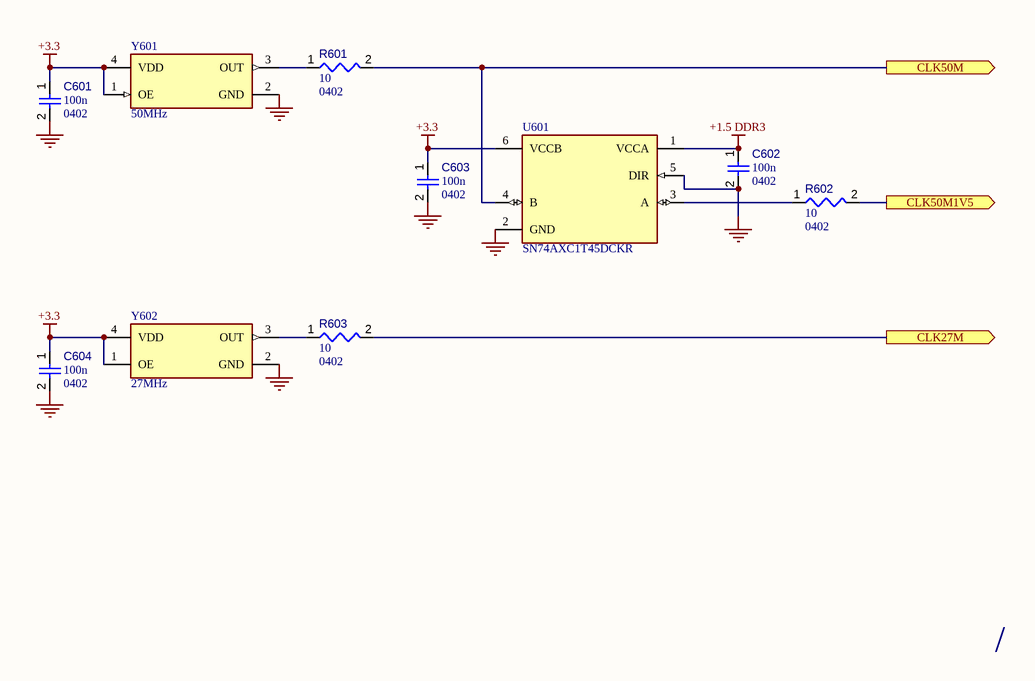
[diagram p5: 6 clock.SchDoc]

### Parts
C601  value 100n  Case/Package: 0402  [CAPC0402(1005)60_L]  (hidden comment: Capacitors,0402,100n,16)
C602  value 100n  Case/Package: 0402  [CAPC0402(1005)60_L]  (hidden comment: Capacitors,0402,100n,16)
C603  value 100n  Case/Package: 0402  [CAPC0402(1005)60_L]  (hidden comment: Capacitors,0402,100n,16)
C604  value 100n  Case/Package: 0402  [CAPC0402(1005)60_L]  (hidden comment: Capacitors,0402,100n,16)
R601  value 10  Case/Package: 0402  [RESC0402(1005)_L]  (hidden comment: Resistors,0402,10)
R602  value 10  Case/Package: 0402  [RESC0402(1005)_L]  (hidden comment: Resistors,0402,10)
R603  value 10  Case/Package: 0402  [RESC0402(1005)_L]  (hidden comment: Resistors,0402,10)
U601  SN74AXC1T45DCKR  [FP-DCK0006A-MFG]
Y601  Frequency: 50MHz  [FP-SiT8008-2-MFG]  (hidden comment: SIT8008BI-23-33E-50.000000E)
Y602  Frequency: 27MHz  [FP-SiT8208-2-MFG]  (hidden comment: SIT8208AI-2F-33E-27.000000Y)

### Ports
CLK27M (out), CLK50M1V5 (out), CLK50M (out)

### Nets
+1.5 DDR3: C602.1 U601.1(VCCA)
+3.3: C601.1 C603.1 C604.1 U601.6(VCCB) Y601.1(OE) Y601.4(VDD) Y602.1(OE) Y602.4(VDD)
GND: C601.2 C602.2 C603.2 C604.2 U601.2(GND) U601.5(DIR) Y601.2(GND) Y602.2(GND)
CLK27M: R603.2 ; port CLK27M
CLK50M: R601.2 U601.4(B) ; port CLK50M
CLK50M1V5: R602.2 ; port CLK50M1V5
NetR601_1: R601.1 Y601.3(OUT)
NetR602_1: R602.1 U601.3(A)
NetR603_1: R603.1 Y602.3(OUT)

### Notes on the sheet
- /

### Library data of the parts
C601-C604 = Capacitors: Capacitor; Voltage Rating: 16; Component Type: Capacitors
R601-R603 = Resistors: Resistor; Component Type: Resistors
U601 = CMP-04899-000070-1: IC TRNSLTR BIDIRECTIONAL SC70-6; Number of Bits: 1; Data Rate: 500Mbps; Channel Type: Bidirectional; Packaging: Tape and Reel; Number of Circuits: 1; Mount: Surface Mount; RoHS Compliant: Yes; Max Operating Temperature: 125°C; Min Operating Temperature: -40°C
Y601 = CMP-25159-264756-1: 50 MHz XO (Standard) HCMOS, LVCMOS Oscillator 3.3V Enable/Disable 4-SMD, No Lead; Max Supply Current: 4.5mA; Frequency Stability: 50ppm; Packaging: Tape and Reel; Max Operating Temperature: 85°C; Case/Package: SMD/SMT; Mount: Surface Mount; RoHS Compliant: Yes; Min Operating Temperature: -40°C; Series: SIT8008B
Y602 = CMP-25159-260479-1: MEMS OSC XO 27.0000MHZ LVCMOS LV; RoHS Compliant: Yes; Series: *

## Sheet 5-4 fpga bank 34-35.SchDoc
size A4; SheetNumber: 8; SheetTotal: 13
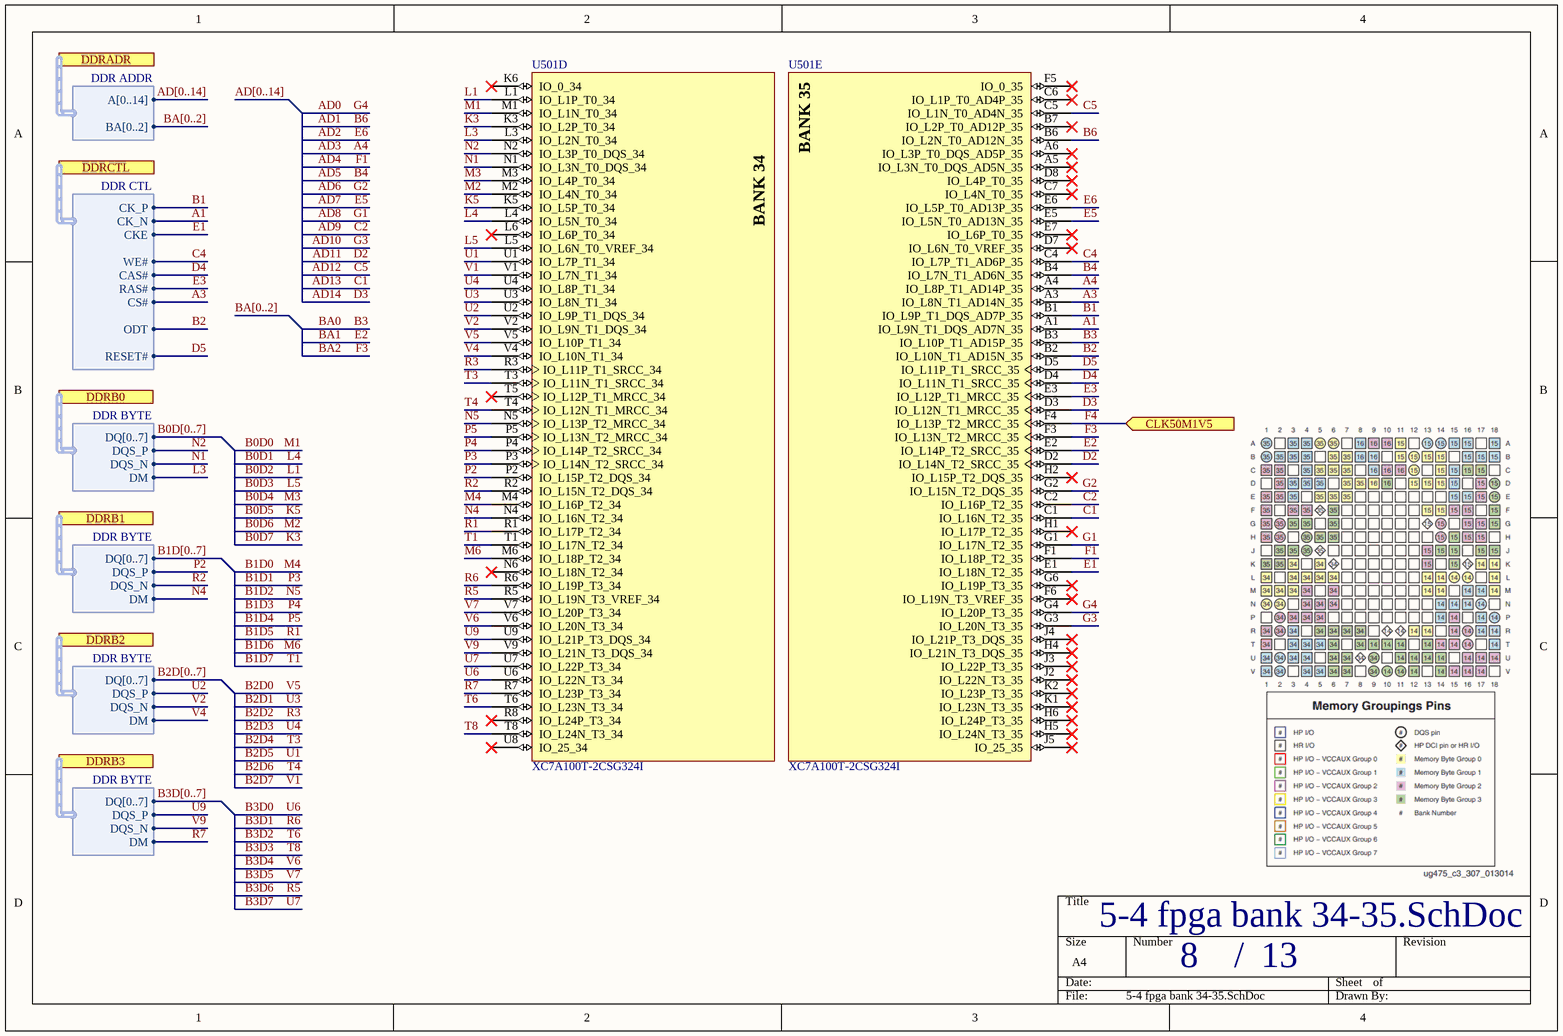
[diagram p6: 5-4 fpga bank 34-35.SchDoc]

### Parts
U501  XC7A100T-2CSG324I  [CSG324]  (parts D,E of 9)

### Ports
CLK50M1V5 (in), DDRADR (harness DDR ADDR), DDRB0 (harness DDR BYTE), DDRB1 (harness DDR BYTE), DDRB2 (harness DDR BYTE), DDRB3 (harness DDR BYTE), DDRCTL (harness DDR CTL)

### Harnesses
DDR ADDR: A[0..14], BA[0..2]
DDR CTL: CK_P, CK_N, CKE, WE#, CAS#, RAS#, CS#, ODT, RESET#
DDR BYTE: DQ[0..7], DQS_P, DQS_N, DM

### Nets
A1: U501.A1(IO_L9N_T1_DQS_AD7N_35) ; port DDRCTL.CK_N  [project net DDRCTL.CK_N]
A3: U501.A3(IO_L8N_T1_AD14N_35) ; port DDRCTL.CS#  [project net DDRCTL.CS#]
A4: U501.A4(IO_L8P_T1_AD14P_35)  [also labelled AD3]  [project net A3]
AD0: U501.G4(IO_L20P_T3_35)  [also labelled G4]  [project net A0]
AD1: U501.B6(IO_L2N_T0_AD12N_35)  [also labelled B6]  [project net A1]
AD2: U501.E6(IO_L5P_T0_AD13P_35)  [also labelled E6]  [project net A2]
AD4: U501.F1(IO_L18P_T2_35)  [also labelled F1]  [project net A4]
AD5: U501.B4(IO_L7N_T1_AD6N_35)  [also labelled B4]  [project net A5]
AD6: U501.G2(IO_L15N_T2_DQS_35)  [also labelled G2]  [project net A6]
AD7: U501.E5(IO_L5N_T0_AD13N_35)  [also labelled E5]  [project net A7]
AD8: U501.G1(IO_L17N_T2_35)  [also labelled G1]  [project net A8]
AD9: U501.C2(IO_L16P_T2_35)  [also labelled C2]  [project net A9]
AD10: U501.G3(IO_L20N_T3_35)  [also labelled G3]  [project net A10]
AD11: U501.D2(IO_L14N_T2_SRCC_35)  [also labelled D2]  [project net A11]
AD12: U501.C5(IO_L1N_T0_AD4N_35)  [also labelled C5]  [project net A12]
AD13: U501.C1(IO_L16N_T2_35)  [also labelled C1]  [project net A13]
AD14: U501.D3(IO_L12N_T1_MRCC_35)  [also labelled D3]  [project net A14]
B0D0: U501.M1(IO_L1N_T0_34)  [also labelled M1]
B0D1: U501.L4(IO_L5N_T0_34)  [also labelled L4]
B0D2: U501.L1(IO_L1P_T0_34)  [also labelled L1]
B0D3: U501.L5(IO_L6N_T0_VREF_34)  [also labelled L5]
B0D4: U501.M3(IO_L4P_T0_34)  [also labelled M3]
B0D5: U501.K5(IO_L5P_T0_34)  [also labelled K5]
B0D6: U501.M2(IO_L4N_T0_34)  [also labelled M2]
B0D7: U501.K3(IO_L2P_T0_34)  [also labelled K3]
B1: U501.B1(IO_L9P_T1_DQS_AD7P_35) ; port DDRCTL.CK_P  [project net DDRCTL.CK_P]
B1D0: U501.M4(IO_L16P_T2_34)  [also labelled M4]
B1D1: U501.P3(IO_L14N_T2_SRCC_34)  [also labelled P3]
B1D2: U501.N5(IO_L13P_T2_MRCC_34)  [also labelled N5]
B1D3: U501.P4(IO_L14P_T2_SRCC_34)  [also labelled P4]
B1D4: U501.P5(IO_L13N_T2_MRCC_34)  [also labelled P5]
B1D5: U501.R1(IO_L17P_T2_34)  [also labelled R1]
B1D6: U501.M6(IO_L18P_T2_34)  [also labelled M6]
B1D7: U501.T1(IO_L17N_T2_34)  [also labelled T1]
B2: U501.B2(IO_L10N_T1_AD15N_35) ; port DDRCTL.ODT  [project net DDRCTL.ODT]
B2D0: U501.V5(IO_L10P_T1_34)  [also labelled V5]
B2D1: U501.U3(IO_L8N_T1_34)  [also labelled U3]
B2D2: U501.R3(IO_L11P_T1_SRCC_34)  [also labelled R3]
B2D3: U501.U4(IO_L8P_T1_34)  [also labelled U4]
B2D4: U501.T3(IO_L11N_T1_SRCC_34)  [also labelled T3]
B2D5: U501.U1(IO_L7P_T1_34)  [also labelled U1]
B2D6: U501.T4(IO_L12N_T1_MRCC_34)  [also labelled T4]
B2D7: U501.V1(IO_L7N_T1_34)  [also labelled V1]
B3: U501.B3(IO_L10P_T1_AD15P_35)  [also labelled BA0]
B3D0: U501.U6(IO_L22N_T3_34)  [also labelled U6]
B3D1: U501.R6(IO_L19P_T3_34)  [also labelled R6]
B3D2: U501.T6(IO_L23N_T3_34)  [also labelled T6]
B3D3: U501.T8(IO_L24N_T3_34)  [also labelled T8]
B3D4: U501.V6(IO_L20N_T3_34)  [also labelled V6]
B3D5: U501.V7(IO_L20P_T3_34)  [also labelled V7]
B3D6: U501.R5(IO_L19N_T3_VREF_34)  [also labelled R5]
B3D7: U501.U7(IO_L22P_T3_34)  [also labelled U7]
BA1: U501.E2(IO_L14P_T2_SRCC_35)  [also labelled E2]
BA2: U501.F3(IO_L13N_T2_MRCC_35)  [also labelled F3]
C4: U501.C4(IO_L7P_T1_AD6P_35) ; port DDRCTL.WE#  [project net DDRCTL.WE#]
D4: U501.D4(IO_L11N_T1_SRCC_35) ; port DDRCTL.CAS#  [project net DDRCTL.CAS#]
D5: U501.D5(IO_L11P_T1_SRCC_35) ; port DDRCTL.RESET#  [project net DDRCTL.RESET#]
E1: U501.E1(IO_L18N_T2_35) ; port DDRCTL.CKE  [project net DDRCTL.CKE]
E3: U501.E3(IO_L12P_T1_MRCC_35) ; port DDRCTL.RAS#  [project net DDRCTL.RAS#]
F4: U501.F4(IO_L13P_T2_MRCC_35) ; port CLK50M1V5  [project net CLK50M1V5]
L3: U501.L3(IO_L2N_T0_34) ; port DDRB0.DM  [project net DDRB0.DM]
N1: U501.N1(IO_L3N_T0_DQS_34) ; port DDRB0.DQS_N  [project net DDRB0.DQS_N]
N2: U501.N2(IO_L3P_T0_DQS_34) ; port DDRB0.DQS_P  [project net DDRB0.DQS_P]
N4: U501.N4(IO_L16N_T2_34) ; port DDRB1.DM  [project net DDRB1.DM]
P2: U501.P2(IO_L15P_T2_DQS_34) ; port DDRB1.DQS_P  [project net DDRB1.DQS_P]
R2: U501.R2(IO_L15N_T2_DQS_34) ; port DDRB1.DQS_N  [project net DDRB1.DQS_N]
R7: U501.R7(IO_L23P_T3_34) ; port DDRB3.DM  [project net DDRB3.DM]
U2: U501.U2(IO_L9P_T1_DQS_34) ; port DDRB2.DQS_P  [project net DDRB2.DQS_P]
U9: U501.U9(IO_L21P_T3_DQS_34) ; port DDRB3.DQS_P  [project net DDRB3.DQS_P]
V2: U501.V2(IO_L9N_T1_DQS_34) ; port DDRB2.DQS_N  [project net DDRB2.DQS_N]
V4: U501.V4(IO_L10N_T1_34) ; port DDRB2.DM  [project net DDRB2.DM]
V9: U501.V9(IO_L21N_T3_DQS_34) ; port DDRB3.DQS_N  [project net DDRB3.DQS_N]

Not connected (* = marked no-connect by the designer): U501 A5(IO_L3N_T0_DQS_AD5N_35)* A6(IO_L3P_T0_DQS_AD5P_35)* B7(IO_L2P_T0_AD12P_35)* C6(IO_L1P_T0_AD4P_35)* C7(IO_L4N_T0_35)* D7(IO_L6N_T0_VREF_35)* D8(IO_L4P_T0_35)* E7(IO_L6P_T0_35)* F5(IO_0_35)* F6(IO_L19N_T3_VREF_35)* G6(IO_L19P_T3_35)* H1(IO_L17P_T2_35)* H2(IO_L15P_T2_DQS_35)* H4(IO_L21N_T3_DQS_35)* H5(IO_L24N_T3_35)* H6(IO_L24P_T3_35)* J2(IO_L22N_T3_35)* J3(IO_L22P_T3_35)* J4(IO_L21P_T3_DQS_35)* J5(IO_25_35)* K1(IO_L23N_T3_35)* K2(IO_L23P_T3_35)* K6(IO_0_34)* L6(IO_L6P_T0_34)* N6(IO_L18N_T2_34)* R8(IO_L24P_T3_34)* T5(IO_L12P_T1_MRCC_34)* U8(IO_25_34)*

### Buses and harness runs
bus AD[0..14]
bus B0D[0..7]
bus B1D[0..7]
bus B2D[0..7]
bus B3D[0..7]
bus BA[0..2]

### Notes on the sheet
- /
- (in symbol CMP-0364-00002-3, part D) BANK 34
- (in symbol CMP-0364-00002-3, part E) BANK 35

### Library data of the parts
U501 = CMP-0364-00002-3: as U501 on sheet 5-1 fgpa power; ComponentLink5URL: http://www.xilinx.com/support/documentation/user_guides/ug475_7Series_Pkg_Pinout.pdf; ComponentLink4Description: Package File; PackageDescription: Wire-Bond Chip-Scale BGA, Body 15 x 15 mm, 0.8 mm Pitch; RoHS: Pb-Free; ComponentLink5Description: Packaging and Pinout; ComponentLink2URL: http://www.xilinx.com/support/documentation/user_guides/ug475_7Series_Pkg_Pinout.pdf; ComponentLink2Description: Package Specification; PartNumber: XC7A100T-2CSG324I; Mounting Technology: Surface Mount; ComponentLink3Description: DC and Switching Characteristics; PackageVersion: Rev 1.8; Code_JEDEC: MO-275-KKAC-1; PackageReference: CSG324; NexusDeviceID: XC7A100T-2CSG324I; ComponentLink4URL: http://www.xilinx.com/support/packagefiles/a7packages/xc7a100tcsg324pkg.txt; ComponentLink3URL: http://www.xilinx.com/support/documentation/data_sheets/ds181_Artix_7_Data_Sheet.pdf; ComponentLink1Description: Datasheet; DatasheetVersion: v1.12; ComponentLink1URL: http://www.xilinx.com/support/documentation/data_sheets/ds180_7Series_Overview.pdf; Generic Part Number: XC7A100T; CLBs (Max Distributed RAM Kb): 1188